# EAGLE design v2164 quad VCA 0402 DIL (EAGLE 9.5.2)
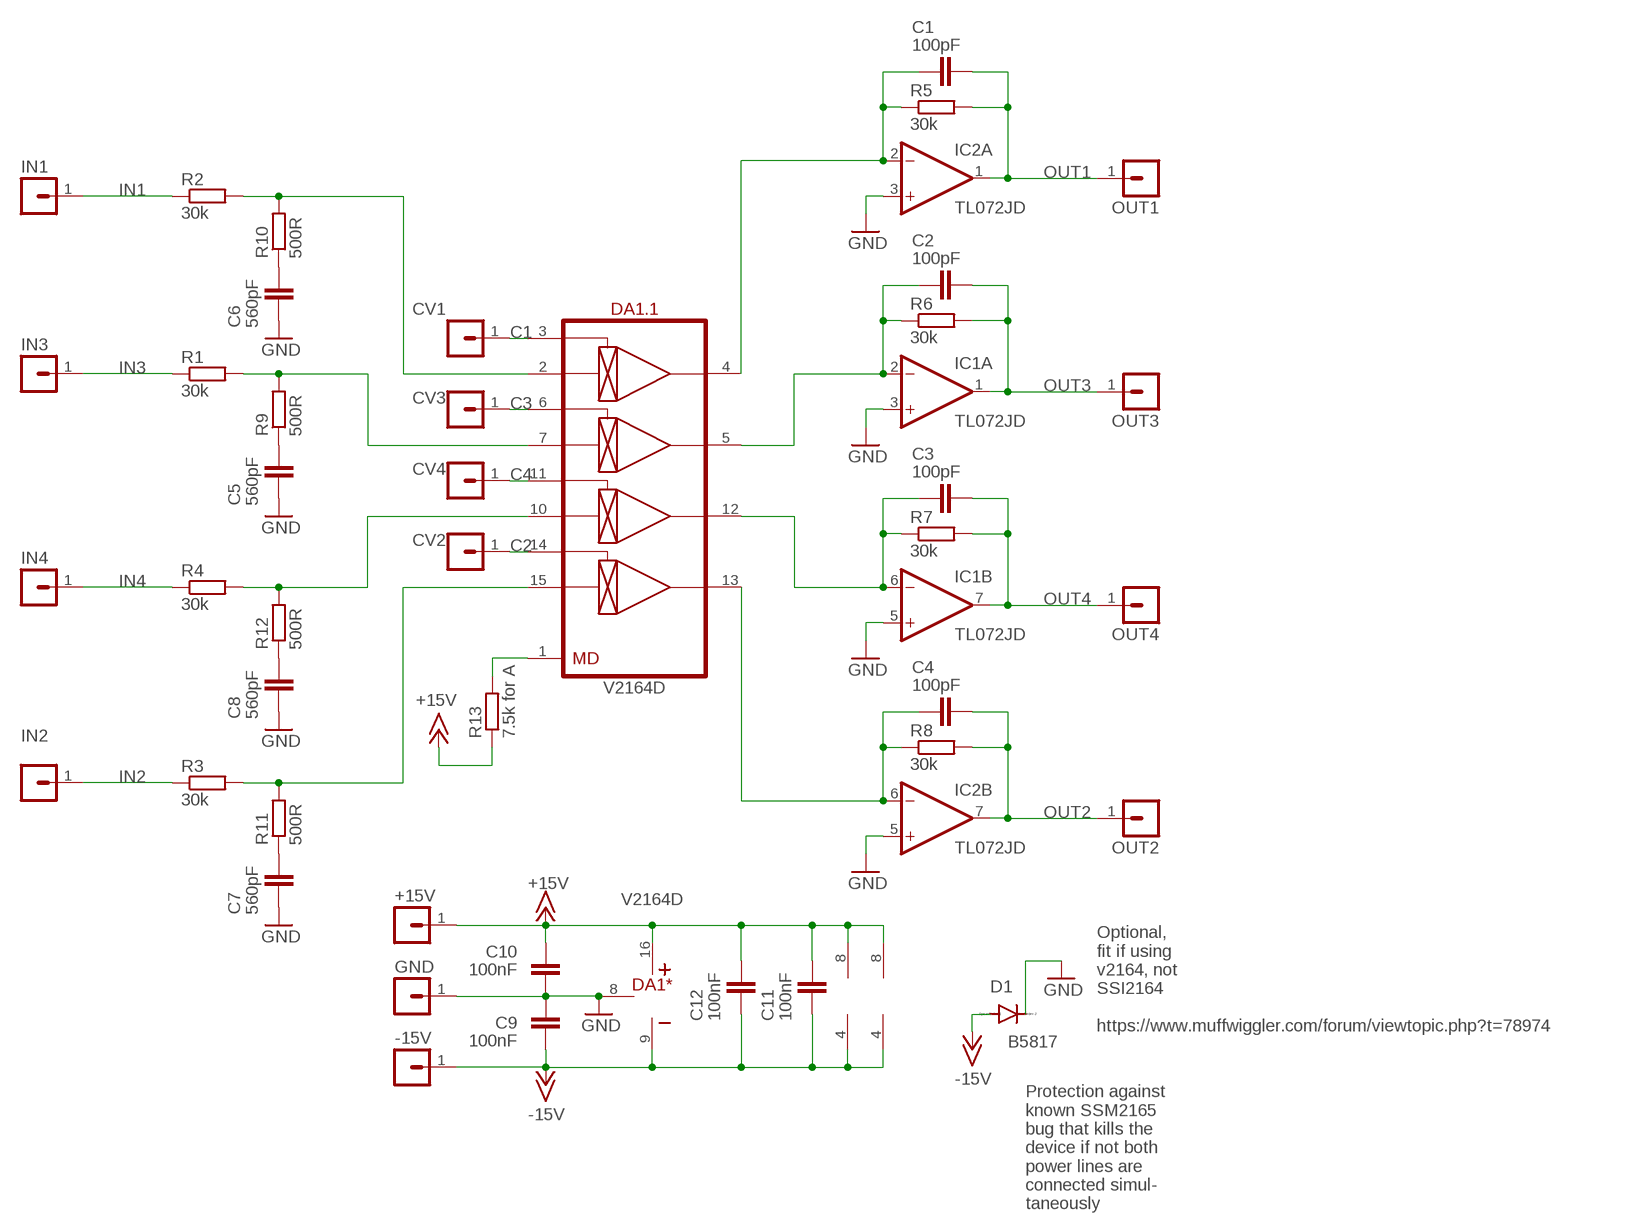
[diagram p0: schematic, sheet 1]

## Parts
+15V  MA01-1JP  [SIP-PIN01-1J]
-15V  MA01-1JP  [SIP-PIN01-1J]
C1  100pF  C-EUC0402  [C0402]
C2  100pF  C-EUC0402  [C0402]
C3  100pF  C-EUC0402  [C0402]
C4  100pF  C-EUC0402  [C0402]
C5  560pF  C-EUC0603  [C0603]
C6  560pF  C-EUC0603  [C0603]
C7  560pF  C-EUC0603  [C0603]
C8  560pF  C-EUC0603  [C0603]
C9  100nF  C-EUC0402  [C0402]
C10  100nF  C-EUC0402  [C0402]
C11  100nF  C-EUC0402  [C0402]
C12  100nF  C-EUC0402  [C0402]
CV1  MA01-1JP  [SIP-PIN01-1J]
CV2  MA01-1JP  [SIP-PIN01-1J]
CV3  MA01-1JP  [SIP-PIN01-1J]
CV4  MA01-1JP  [SIP-PIN01-1J]
D1  B5817  DIODE-SOD323-R  [SOD323-R]
DA1  V2164D  [DIP-16]
GND  MA01-1JP  [SIP-PIN01-1J]
IC1  TL072JD  [SO08J]
IC2  TL072JD  [SO08J]
IN1  MA01-1JP  [SIP-PIN01-1J]
IN2  MA01-1JP  [SIP-PIN01-1J]
IN3  MA01-1JP  [SIP-PIN01-1J]
IN4  MA01-1JP  [SIP-PIN01-1J]
OUT1  MA01-1JP  [SIP-PIN01-1J]
OUT2  MA01-1JP  [SIP-PIN01-1J]
OUT3  MA01-1JP  [SIP-PIN01-1J]
OUT4  MA01-1JP  [SIP-PIN01-1J]
R1  30k  R-EU_R0402  [R0402]
R2  30k  R-EU_R0402  [R0402]
R3  30k  R-EU_R0402  [R0402]
R4  30k  R-EU_R0402  [R0402]
R5  30k  R-EU_R0402  [R0402]
R6  30k  R-EU_R0402  [R0402]
R7  30k  R-EU_R0402  [R0402]
R8  30k  R-EU_R0402  [R0402]
R9  500R  R-EU_R0402  [R0402]
R10  500R  R-EU_R0402  [R0402]
R11  500R  R-EU_R0402  [R0402]
R12  500R  R-EU_R0402  [R0402]
R13  7.5k for A  R-EU_R0402  [R0402]

## Nets
+15V: +15V.1 C10.2 C11.2 C12.2 DA1.16(*:V+) IC1.8(P:V+) IC2.8(P:V+) R13.1
-15V: -15V.1 C9.1 C11.1 C12.1 D1.A DA1.9(*:V-) IC1.4(P:V-) IC2.4(P:V-)
C1: CV1.1 DA1.3(.1:CV1)
C2: CV2.1 DA1.14(.1:CV4)
C3: CV3.1 DA1.6(.1:CV2)
C4: CV4.1 DA1.11(.1:CV3)
GND: C5.1 C6.1 C7.1 C8.1 C9.2 C10.1 D1.C DA1.8(*:GND) GND.1 IC1.3(A:+IN) IC1.5(B:+IN) IC2.3(A:+IN) IC2.5(B:+IN)
IN1: IN1.1 R2.1
IN2: IN2.1 R3.1
IN3: IN3.1 R1.1
IN4: IN4.1 R4.1
N$1: C4.1 DA1.13(.1:OUT4) IC2.6(B:-IN) R8.1
N$2: DA1.1(.1:MD) R13.2
N$3: C3.1 DA1.12(.1:OUT3) IC1.6(B:-IN) R7.1
N$5: C2.1 DA1.5(.1:OUT2) IC1.2(A:-IN) R6.1
N$7: C1.1 DA1.4(.1:OUT1) IC2.2(A:-IN) R5.1
N$9: C5.2 R9.1
N$10: C6.2 R10.1
N$11: C7.2 R11.1
N$12: C8.2 R12.1
N$17: DA1.7(.1:IN2) R1.2 R9.2
N$18: DA1.2(.1:IN1) R2.2 R10.2
N$19: DA1.15(.1:IN4) R3.2 R11.2
N$20: DA1.10(.1:IN3) R4.2 R12.2
OUT1: C1.2 IC2.1(A:OUT) OUT1.1 R5.2
OUT2: C4.2 IC2.7(B:OUT) OUT2.1 R8.2
OUT3: C2.2 IC1.1(A:OUT) OUT3.1 R6.2
OUT4: C3.2 IC1.7(B:OUT) OUT4.1 R7.2

## Notes on the sheet
- Optional,
  fit if using
  v2164, not
  SSI2164
  
  https://www.muffwiggler.com/forum/viewtopic.php?t=78974
- Protection against
  known SSM2165
  bug that kills the
  device if not both
  power lines are 
  connected simul-
  taneously

## Library data of the parts
+15V -15V CV1-CV4 GND IN1-IN4 OUT1-OUT4 = joakim:MA01-1J: PIN HEADER
C1-C12 = rcl:C-EU: CAPACITOR, European symbol; SPICEPREFIX: C
D1 = diode:DIODE-: DIODE
DA1 = ic-coolaudio:V2164
IC1 IC2 = joakim:TL072J: OP AMP
R1-R13 = rcl:R-EU_: RESISTOR, European symbol; SPICEPREFIX: R

## Board
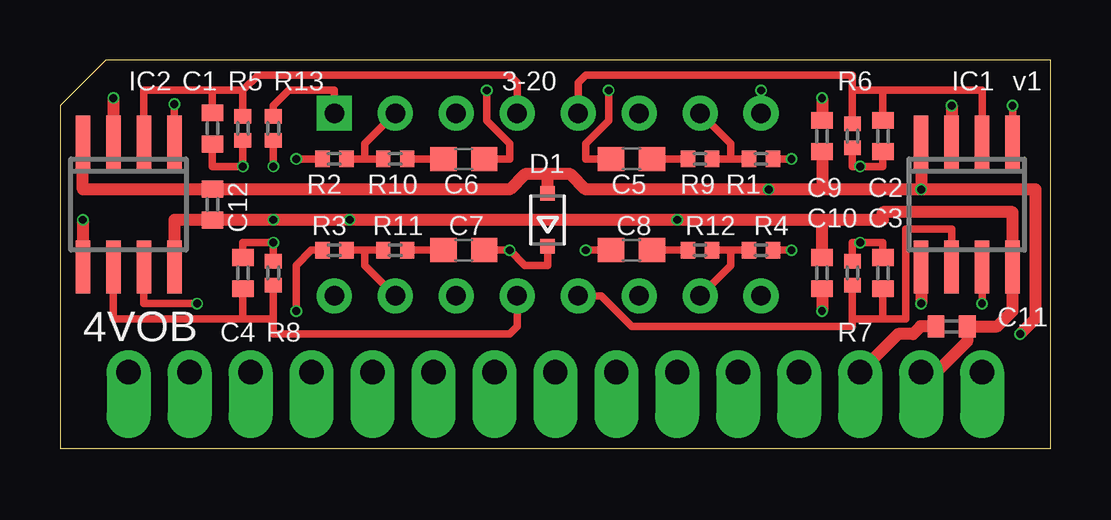
[diagram p1: board, top side]
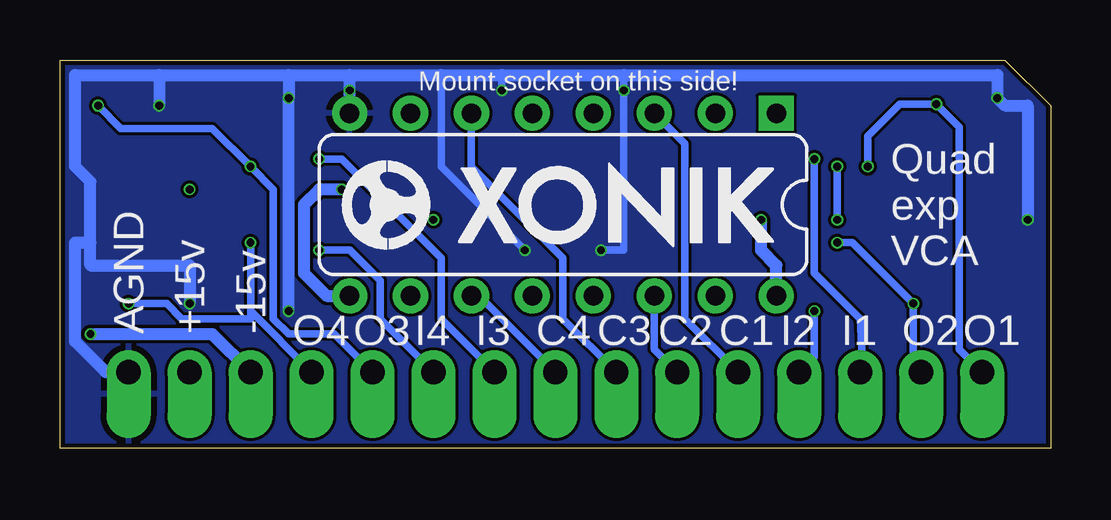
[diagram p2: board, bottom side, seen from below]

Size 41.27 x 16.19 mm. Coordinates in mm from the lower left corner, seen from the top.
Outline: 0,0 41.27,0 41.27,16.19 1.91,16.19 0,14.29 0,0
Copper layers (1*16): Top 0.035mm / dielectric 1.6mm / Bottom 0.035mm
Design rules "jlcpcb-2layers": minimum track width 5mil, minimum drill 0.3mm, track to track 5mil, track to pad 5mil, pad to pad 5mil, via to via 5mil, smd to smd 5mil, copper to edge 0.2mm, drill to drill 6mil, minimum pad ring 10mil, minimum via ring 3mil, stop-mask expansion 4mil, vias tented up to drill 0mil, thermal gap 10mil

### Footprints (pad centres in the part's own frame; a part is rotated, then mirrored left to right if it is on the bottom)
SIP-PIN01-1J = drill 1.016 offset: 1 0,0
C0402 = smd 0.7 x 0.9: 1 -0.65,0; 2 0.65,0
C0603 = smd 1.1 x 1: 1 -0.85,0; 2 0.85,0
SOD323-R = smd 0.6 x 0.6: A 1.1,0; C -1.1,0
DIP-16 = drill 0.813 square: 1 -8.89,-3.81 | drill 0.813: 2 -6.35,-3.81; 3 -3.81,-3.81; 4 -1.27,-3.81; 5 1.27,-3.81; 6 3.81,-3.81; 7 6.35,-3.81; 8 8.89,-3.81; 9 8.89,3.81; 10 6.35,3.81; 11 3.81,3.81; 12 1.27,3.81; 13 -1.27,3.81; 14 -3.81,3.81; 15 -6.35,3.81; 16 -8.89,3.81
SO08J = smd 0.6 x 2.2: 1 -1.905,-2.6; 2 -0.635,-2.6; 3 0.635,-2.6; 4 1.905,-2.6; 5 1.905,2.6; 6 0.635,2.6; 7 -0.635,2.6; 8 -1.905,2.6
R0402 = smd 0.6 x 0.7: 1 -0.5,0; 2 0.5,0

### Placement (x,y rotation side)
+15V  35.88,3.17 0 top
-15V  33.34,3.17 0 top
C1  6.35,13.34 270 top
C2  34.29,13.02 270 top
C3  34.29,7.3 90 top
C4  7.62,7.3 90 top
C5  23.81,12.06 0 top
C6  16.83,12.06 180 top
C7  16.83,8.26 180 top
C8  23.81,8.26 0 top
C9  31.75,13.02 90 top
C10  31.75,7.3 90 top
C11  37.15,5.08 0 top
C12  6.35,10.16 270 top
CV1  13.02,3.17 0 top
CV2  15.56,3.17 0 top
CV3  18.1,3.17 0 top
CV4  20.64,3.17 0 top
D1  20.32,9.53 90 top
DA1  20.32,10.16 180 bottom
GND  38.42,3.17 0 top
IC1  37.78,10.16 180 top
IC2  2.86,10.16 180 top
IN1  7.94,3.17 0 top
IN2  10.48,3.17 0 top
IN3  23.18,3.17 0 top
IN4  25.72,3.17 0 top
OUT1  2.86,3.17 0 top
OUT2  5.4,3.17 0 top
OUT3  28.26,3.17 0 top
OUT4  30.8,3.17 0 top
R1  29.21,12.06 180 top
R2  11.43,12.06 0 top
R3  11.43,8.26 0 top
R4  29.21,8.26 180 top
R5  7.62,13.34 270 top
R6  33.02,13.02 270 top
R7  33.02,7.3 90 top
R8  8.89,7.3 90 top
R9  26.67,12.06 0 top
R10  13.97,12.06 180 top
R11  13.97,8.26 180 top
R12  26.67,8.26 0 top
R13  8.89,13.34 90 top
U$1  [XONIK_LOGO_18]  29.53,8.31 0 bottom

### Tracks (layer width: path | path; a pad name or v marks a point on that pad's centre or on a via)
+15V  (via drill 0.33)
  Top 0.305: R13.1 v8.89,11.75
  Top 0.508: IC2.8 4.76,9.53 6.35,9.53 | 31.75,9.53 34.29,9.53 34.29,9.84 39.69,9.84 IC1.8 39.69,5.71 39.05,5.08 C11.2 37.8,4.45 36.53,3.17 +15V.1 | 31.75,9.53 v25.72,9.53 v12.06,9.53 v8.89,9.53 6.35,9.53 | C12.2 6.35,9.53 | C10.2 31.75,9.53
  Bottom 0.305: v8.89,11.75 v8.89,9.53
  Bottom 0.508: DA1.16 11.43,7.62 12.06,8.26 v12.06,9.53
-15V  (via drill 0.33)
  Top 0.508: IC1.4 v35.88,10.79 | IC2.4 0.95,10.79 6.35,10.79 | v35.88,10.79 31.75,10.79 | 31.75,10.79 v29.53,10.79 21.91,10.79 21.27,11.43 20.32,11.43 | 20.32,11.43 19.37,11.43 18.73,10.79 6.35,10.79 | C12.1 6.35,10.79 | C9.1 31.75,10.79 | C11.1 35.86,5.08 35.55,4.76 34.92,4.76 -15V.1 | v40.01,4.76 40.64,5.4 40.64,10.79 v35.88,10.79 | D1.A 20.32,11.43
  Bottom 0.508: v29.53,10.79 30.48,10.79 31.11,10.16 31.11,7.3 30.16,6.35 DA1.9 | v40.01,4.76 34.92,4.76 -15V.1
C1
  Bottom 0.305: DA1.3 15.24,12.7 15.24,5.4 CV1.1
C2
  Bottom 0.305: CV2.1 16.51,4.13 DA1.14
C3
  Bottom 0.305: DA1.6 24.13,11.75 20.32,7.94 20.32,5.4 CV3.1
C4
  Bottom 0.305: CV4.1 23.81,6.35 DA1.11
GND  (via drill 0.33)
  Top 0.305: C6.1 18.73,12.06 18.73,12.7 17.78,13.65 v17.78,14.92 | C7.1 v18.73,8.26 19.37,7.62 20.32,7.62 D1.C | C5.1 21.91,12.06 21.91,12.7 22.86,13.65 v22.86,14.92 | C8.1 v21.91,8.26
  Top 0.508: v31.75,14.61 C9.2 | C10.1 v31.75,5.71 | v37.15,14.29 IC1.3 | IC1.5 v35.88,6.03 | v2.22,14.61 IC2.3 | v0.95,9.53 IC2.5
  Bottom 0.305: 17.78,15.56 v17.78,14.92 17.78,8.26 v18.73,8.26 | v22.86,14.92 22.86,15.56 | v21.91,8.26 25.4,11.75 25.4,15.56
  Bottom 0.508: 37.15,15.56 40.64,15.56 40.64,11.75 40.01,11.11 40.01,8.57 | 37.15,15.56 31.75,15.56 | 31.75,15.56 29.21,15.56 | 29.21,15.56 25.4,15.56 22.86,15.56 17.78,15.56 2.22,15.56 v2.22,14.61 1.91,14.29 0.95,14.29 v0.95,9.53 | 29.21,15.56 v29.21,14.92 DA1.8 | 31.75,15.56 v31.75,14.61 v31.75,5.71 | 37.15,15.56 v37.15,14.29 | 40.01,8.57 40.01,7.62 35.88,7.62 v35.88,6.03 | GND.1 39.37,3.17 40.64,4.45 40.64,8.57 40.01,8.57
  pour Bottom: 0,0 0,16.19 41.27,16.19 41.27,0
IN1  (via drill 0.33)
  Top 0.305: v9.84,12.06 R2.1
  Bottom 0.305: IN1.1 7.88,3.23 7.88,4.23 7.94,5.4 9.84,7.3 v9.84,12.06
IN2  (via drill 0.33)
  Top 0.305: R3.1 10.48,8.26 9.84,7.62 v9.84,5.71
  Bottom 0.305: v9.84,5.71 9.84,3.81 IN2.1
IN3  (via drill 0.33)
  Top 0.305: v30.48,12.06 R1.1
  Bottom 0.305: IN3.1 25.4,5.4 25.4,7.94 29.53,12.06 v30.48,12.06
IN4  (via drill 0.33)
  Top 0.305: R4.1 v30.48,8.26
  Bottom 0.305: v30.48,8.26 29.21,8.26 27.94,6.99 27.94,5.4 IN4.1
N$1
  Top 0.305: R8.1 8.89,5.4 | 8.89,5.4 7.62,5.4 | C4.1 7.62,5.4 | IC2.6 2.22,5.4 7.62,5.4 | 8.89,5.4 8.89,4.76 18.73,4.76 19.05,5.08 DA1.13
N$2
  Top 0.305: DA1.1 11.43,14.92 9.53,14.92 8.89,14.29 R13.2
N$3
  Top 0.305: R7.1 33.02,5.4 | 33.02,5.4 34.29,5.4 | 34.29,5.4 35.24,5.4 35.24,9.15 37.15,9.15 IC1.6 | C3.1 34.29,5.4 | 33.02,5.4 33.02,5.08 23.81,5.08 22.54,6.35 DA1.12
N$5
  Top 0.305: 34.29,14.92 33.02,14.92 | 33.02,14.92 R6.1 | C2.1 34.29,14.92 | IC1.2 38.42,14.92 34.29,14.92 | 33.02,14.92 33.02,15.56 21.91,15.56 21.59,15.24 DA1.5
N$7
  Top 0.305: C1.1 6.35,14.92 | 7.62,14.92 R5.1 | IC2.2 3.49,14.92 6.35,14.92 | 6.35,14.92 7.62,14.92 | DA1.4 19.05,15.24 18.73,15.56 8.26,15.56 7.62,14.92
N$9
  Top 0.305: R9.1 C5.2
N$10
  Top 0.305: R10.1 C6.2
N$11
  Top 0.305: C7.2 R11.1
N$12
  Top 0.305: R12.1 C8.2
N$17
  Top 0.305: R1.2 27.94,12.06 | 27.94,12.06 R9.2 | 27.94,12.06 27.94,12.7 DA1.7
N$18
  Top 0.305: R2.2 12.7,12.06 | 12.7,12.06 R10.2 | 12.7,12.06 12.7,12.7 DA1.2
N$19
  Top 0.305: R11.2 12.7,8.26 | 12.7,8.26 R3.2 | DA1.15 12.7,7.62 12.7,8.26
N$20
  Top 0.305: R4.2 27.94,8.26 | 27.94,8.26 R12.2 | DA1.10 27.94,7.62 27.94,8.26
OUT1  (via drill 0.33)
  Top 0.305: C1.2 6.35,11.75 v7.62,11.75 R5.2 | IC2.1 v4.76,14.35
  Bottom 0.305: OUT1.1 3.81,4.13 3.81,13.39 v4.76,14.35 6.29,14.35 7.62,13.02 v7.62,11.75
OUT2  (via drill 0.33)
  Top 0.305: R8.2 v8.89,8.57 7.62,8.57 C4.2 | IC2.7 3.49,6.03 v5.71,6.03
  Bottom 0.305: OUT2.1 5.71,3.49 v5.71,6.03 8.26,8.57 v8.89,8.57
OUT3  (via drill 0.33)
  Top 0.305: R6.2 33.02,11.75 v33.34,11.75 34.29,11.75 C2.2 | IC1.1 v39.69,14.29
  Bottom 0.305: v39.69,14.29 38.73,13.34 34.92,13.34 v33.34,11.75 32.38,10.79 32.38,5.4 31.75,4.76 29.84,4.76 OUT3.1
OUT4  (via drill 0.33)
  Top 0.305: R7.2 33.02,8.57 v33.34,8.57 34.29,8.57 C3.2 | IC1.7 v38.42,6.03
  Bottom 0.305: v38.42,6.03 36.83,6.03 36.2,5.4 33.34,5.4 33.34,5.71 | OUT4.1 33.34,5.71 | 33.34,5.71 v33.34,8.57

### Text on the board
tNames: 3-20 | v1 | 4VOB
bNames: Mount socket on this side! | Quad / exp / VCA | -15v | +15v | AGND | O1 | O2 | I1 | I2 | C1 | C2 | C3 | C4 | I3 | I4 | O3 | O4